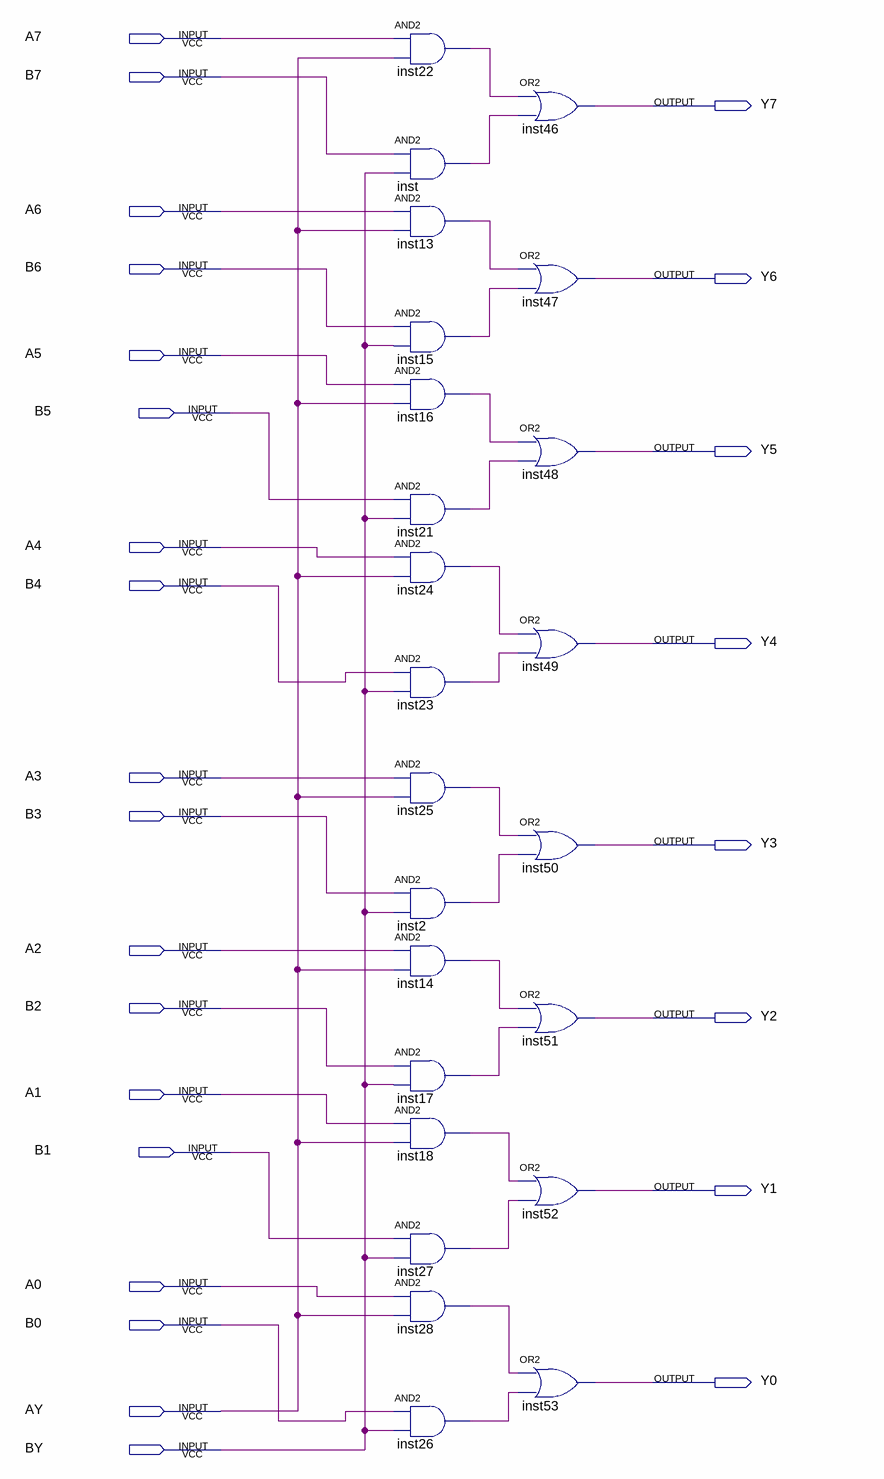
[diagram p0: schematic sheet]
// Quartus schematic selector2.bdf as structural Verilog: 24 symbols, 26 pins
module selector2 (
  input  A7,
  input  B7,
  input  A6,
  input  B6,
  input  A5,
  input  B5,
  input  A4,
  input  B4,
  input  A3,
  input  B3,
  input  A2,
  input  B2,
  input  A1,
  input  B1,
  input  A0,
  input  B0,
  input  AY,
  input  BY,
  output Y7,
  output Y6,
  output Y5,
  output Y4,
  output Y3,
  output Y2,
  output Y1,
  output Y0
);

  wire inst2_out, inst13_out, inst14_out, inst15_out, inst16_out, inst17_out, inst18_out, inst21_out,
       inst22_out, inst23_out, inst24_out, inst25_out, inst26_out, inst27_out, inst28_out, inst_out;

  and inst22 (inst22_out, A7, AY);
  and inst (inst_out, B7, BY);
  and inst13 (inst13_out, A6, AY);
  and inst15 (inst15_out, B6, BY);
  and inst16 (inst16_out, A5, AY);
  and inst21 (inst21_out, B5, BY);
  and inst24 (inst24_out, A4, AY);
  and inst23 (inst23_out, B4, BY);
  and inst25 (inst25_out, A3, AY);
  and inst2 (inst2_out, B3, BY);
  and inst14 (inst14_out, A2, AY);
  and inst17 (inst17_out, B2, BY);
  and inst18 (inst18_out, A1, AY);
  and inst27 (inst27_out, B1, BY);
  and inst28 (inst28_out, A0, AY);
  and inst26 (inst26_out, B0, BY);
  or inst46 (Y7, inst22_out, inst_out);
  or inst47 (Y6, inst13_out, inst15_out);
  or inst48 (Y5, inst16_out, inst21_out);
  or inst49 (Y4, inst24_out, inst23_out);
  or inst50 (Y3, inst25_out, inst2_out);
  or inst51 (Y2, inst14_out, inst17_out);
  or inst52 (Y1, inst18_out, inst27_out);
  or inst53 (Y0, inst28_out, inst26_out);
endmodule
